# Altium schematic sheet FPGA_CONFIG.SchDoc
size A4
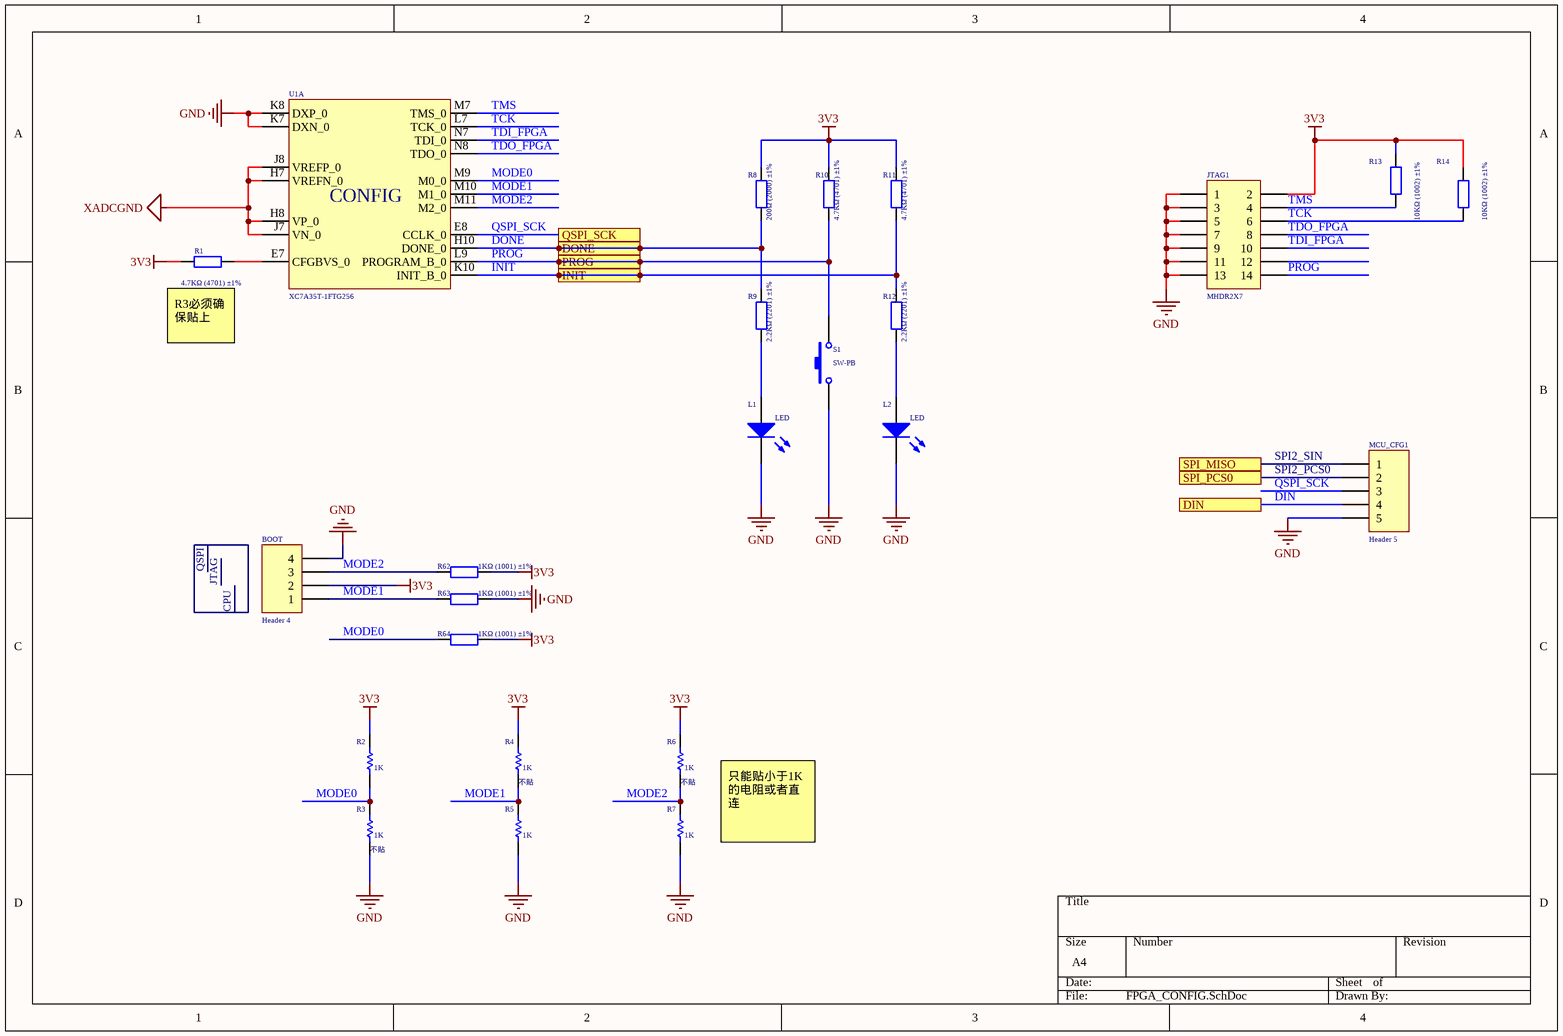
[diagram p0: FPGA_CONFIG.SchDoc]

## Parts
BOOT  Header 4  [HDR1X4]
JTAG1  MHDR2X7  [SMT7*2-2MM]
L1  LED  [1608[0603]]
L2  LED  [1608[0603]]
MCU_CFG1  Header 5  [MHDR1X5]
R1  4.7KΩ (4701) ±1%  [0402_R]
R2  value 1K  [1608[0603]]  (hidden comment: Res)
R3  不贴  value 1K  [1608[0603]]
R4  不贴  value 1K  [1608[0603]]
R5  value 1K  [1608[0603]]  (hidden comment: Res)
R6  不贴  value 1K  [1608[0603]]
R7  value 1K  [1608[0603]]  (hidden comment: Res)
R8  200Ω (2000) ±1%  [0402_R]
R9  2.2KΩ (2201) ±1%  [0402_R]
R10  4.7KΩ (4701) ±1%  [0402_R]
R11  4.7KΩ (4701) ±1%  [0402_R]
R12  2.2KΩ (2201) ±1%  [0402_R]
R13  10KΩ (1002) ±1%  [0402_R]
R14  10KΩ (1002) ±1%  [0402_R]
R62  1KΩ (1001) ±1%  [0402_R]
R63  1KΩ (1001) ±1%  [0402_R]
R64  1KΩ (1001) ±1%  [0402_R]
S1  SW-PB  [key 3*4*2]
U1  XC7A35T-1FTG256  [BGA100P9X9-81A]  (part A of 7)

## Ports
DIN, DONE, INIT, PROG, QSPI_SCK, SPI_MISO, SPI_PCS0

## Nets
3V3: BOOT.2 JTAG1.2 R1.1 R2.2 R4.2 R6.2 R8.2 R10.2 R11.2 R13.2 R14.2 R62.2 R64.2
GND: BOOT.4 JTAG1.1 JTAG1.3 JTAG1.5 JTAG1.7 JTAG1.9 JTAG1.11 JTAG1.13 L1.2(K) L2.2(K) MCU_CFG1.5 R3.1 R5.1 R7.1 R63.2 S1.1 U1.K7(DXN_0) U1.K8(DXP_0)
XADCGND: U1.H7(VREFN_0) U1.H8(VP_0) U1.J7(VN_0) U1.J8(VREFP_0)
DIN: MCU_CFG1.4 ; port DIN
DONE: R8.1 R9.2 U1.H10(DONE_0) ; port DONE
INIT: R11.1 R12.2 U1.K10(INIT_B_0) ; port INIT
MODE0: R2.1 R3.2 R64.1 U1.M9(M0_0)
MODE1: BOOT.1 R4.1 R5.2 R63.1 U1.M10(M1_0)
MODE2: BOOT.3 R6.1 R7.2 R62.1 U1.M11(M2_0)
PROG: JTAG1.14 R10.1 S1.2 U1.L9(PROGRAM_B_0) ; port PROG
QSPI_SCK: MCU_CFG1.3 U1.E8(CCLK_0) ; port QSPI_SCK
SPI2_PCS0: MCU_CFG1.2 ; port SPI_PCS0
SPI2_SIN: MCU_CFG1.1 ; port SPI_MISO
TCK: JTAG1.6 R14.1 U1.L7(TCK_0)
TDI_FPGA: JTAG1.10 U1.N7(TDI_0)
TDO_FPGA: JTAG1.8 U1.N8(TDO_0)
TMS: JTAG1.4 R13.1 U1.M7(TMS_0)
NetL1_1: L1.1(A) R9.1
NetL2_1: L2.1(A) R12.1
NetR1_2: R1.2 U1.E7(CFGBVS_0)

Not connected (* = marked no-connect by the designer): JTAG1 12

## Notes on the sheet
- (near R1) R3必须确保贴上
- QSPI
- JTAG
- CPU
- 只能贴小于1K的电阻或者直连
- (in symbol XC7A35T-1FTG256, part A) CONFIG

## Library data of the parts
BOOT = Header 4: Header, 4-Pin; LatestRevisionDate: 17-Jul-2002; LatestRevisionNote: Re-released for DXP Platform.; Publisher: Altium Limited
JTAG1 = MHDR2X7: Header, 7-Pin, Dual row; LatestRevisionDate: 17-Jul-2002; LatestRevisionNote: Re-released for DXP Platform.; Publisher: Altium Limited
MCU_CFG1 = Header 5: Header, 5-Pin; LatestRevisionDate: 17-Jul-2002; LatestRevisionNote: Re-released for DXP Platform.; Publisher: Altium Limited
R1 R10 R11 = 0402 4.7KΩ (4701) 1%: 贴片电阻; ComponentLink1Description: 供应商链接; ComponentLink1URL: http://www.szlcsc.com/product/details_26643.html; Package: 0402; Supplier: LC; SuppliersPartNumber: C25900
R2-R7 = Res: 贴片电阻; Published: 8-Jun-2000; LatestRevisionDate: 17-Jul-2002; LatestRevisionNote: Re-released for DXP Platform.; PackageReference: AXIAL-0.3; Publisher: Altium Limited
R8 = 0402 200Ω (2000) 1%: 贴片电阻; ComponentLink1Description: 供应商链接; ComponentLink1URL: http://www.szlcsc.com/product/details_25830.html; Package: 0402; Supplier: LC; SuppliersPartNumber: C25087
R9 R12 = 0402 2.2KΩ (2201) 1%: 贴片电阻; ComponentLink1Description: 供应商链接; ComponentLink1URL: http://www.szlcsc.com/product/details_26622.html; Package: 0402; Supplier: LC; SuppliersPartNumber: C25879
R13 R14 = 0402 10KΩ (1002) 1%: 贴片电阻; ComponentLink1Description: 供应商链接; ComponentLink1URL: http://www.szlcsc.com/product/details_26487.html; Package: 0402; Supplier: LC; SuppliersPartNumber: C25744
R62-R64 = 0402 1KΩ (1001) 1%: 贴片电阻; ComponentLink1Description: 供应商链接; ComponentLink1URL: http://www.szlcsc.com/product/details_12256.html; Package: 0402; Supplier: LC; SuppliersPartNumber: C11702
S1 = SW-PB: Switch; Published: 24-Mar-1999; LatestRevisionDate: 17-Jul-2002; LatestRevisionNote: Re-released for DXP Platform.; PackageReference: SPST-2; Publisher: Altium Limited; PackageDescription: Switch; 2 Leads